# Altium project Shuttler_AMC.PrjPcb (part 12 of 20)

## Sheet DAC_LTC2000.SchDoc: =ProjectName
size 420 x 297 mm; Author: T.P.; CompanyName: WUT; DrawnBy: T.P.; Organization: WUT ISE; Address1: Warsaw Univeristy of Technology; Address2: Nowowiejska 15/19; DocumentNumber: 18; Revision: 0.9; SheetNumber: 18; SheetTotal: 36; EDA_Number: ARTIQ; Projet: ARTIQ/SINARA; ModifiedBy: -; CreateDate: XX/XX/XXXX; CheckedDate: -; Title2: DAC_LTC2000.SchDoc; DivGrp: ISE; Designer: G.K. and T.P.; ModifiedDate: -; ProjectName: ADC/DAC MEZZANINE
Used 18 times, as channels DACs/U_DAC_LTC2000, DACs/U_DAC_LTC2000, DACs/U_DAC_LTC2000, DACs/U_DAC_LTC2000, DACs/U_DAC_LTC2000, DACs/U_DAC_LTC2000, DACs/U_DAC_LTC2000, DACs/U_DAC_LTC2000, DACs/U_DAC_LTC2000, DACs/U_DAC_LTC2000, DACs/U_DAC_LTC2000, DACs/U_DAC_LTC2000, DACs/U_DAC_LTC2000, DACs/U_DAC_LTC2000, DACs/U_DAC_LTC2000, DACs/U_DAC_LTC2000, DACs/U_DAC_LTC2000, DACs/U_DAC_LTC2000. Parts and nets are listed once, with the designators drawn on the sheet.
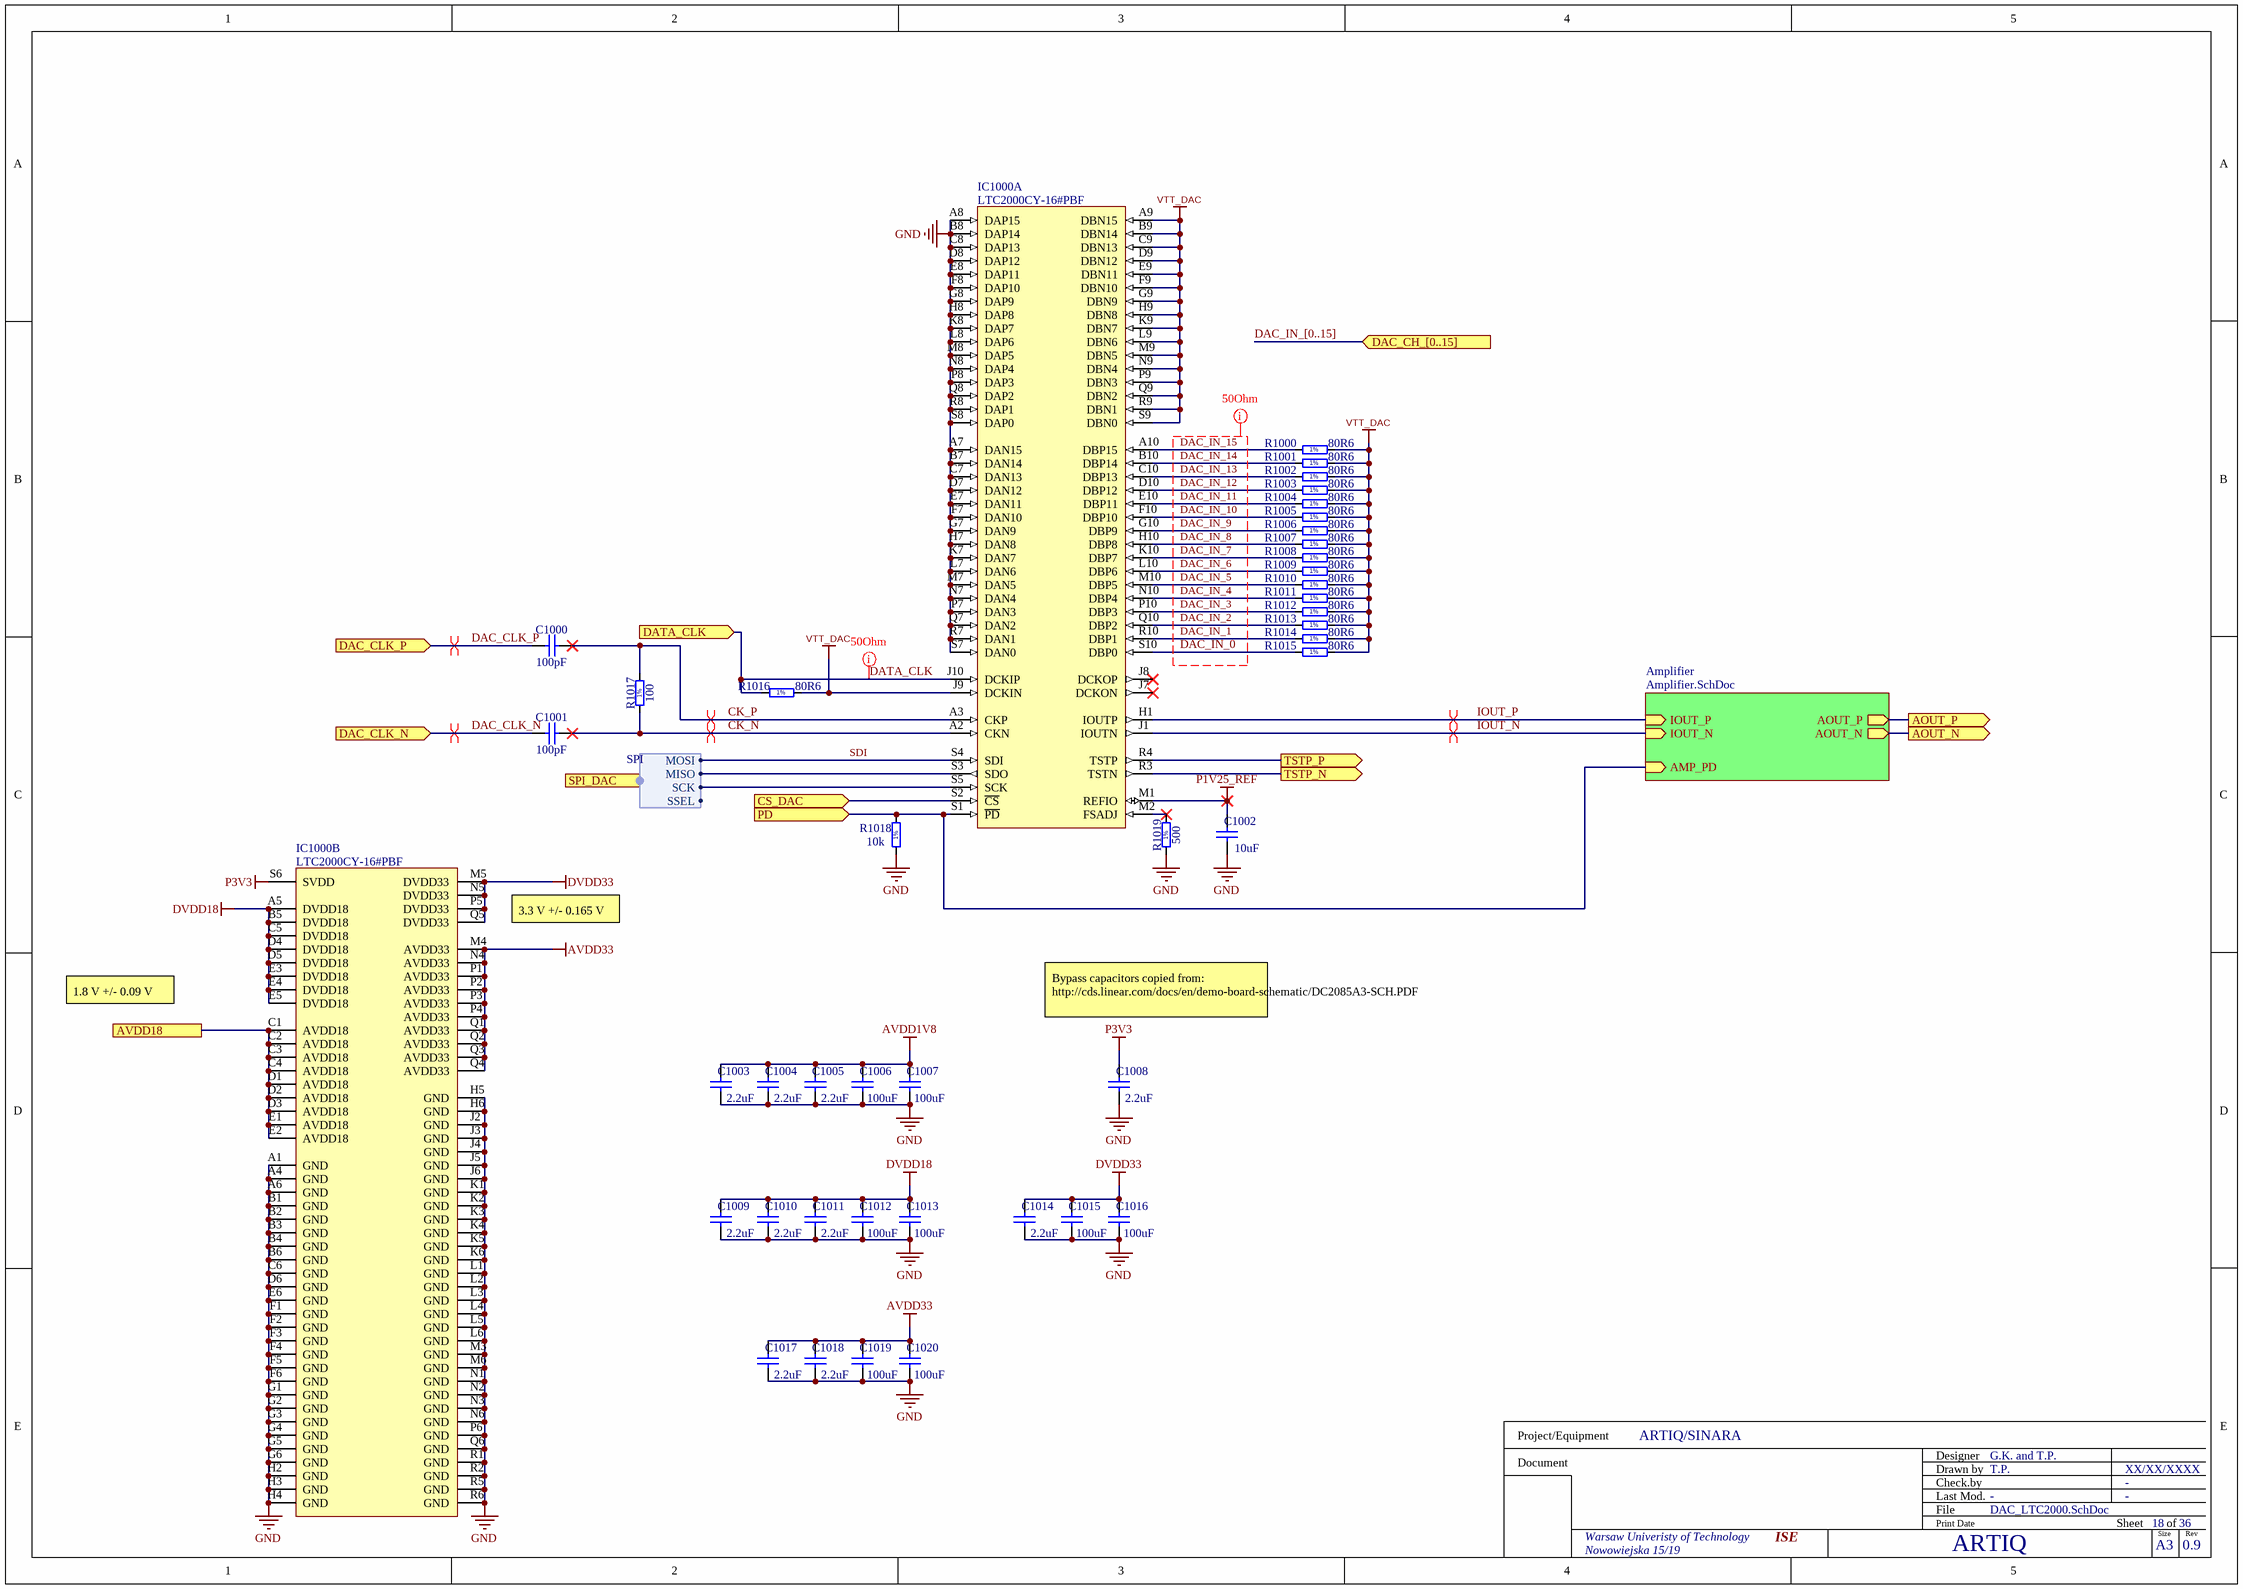
[diagram p22: DAC_LTC2000.SchDoc]

### Parts
C1000  100pF  [CAPC1005X55N]
C1001  100pF  [CAPC1005X55N]
C1002  10uF  [CAPC1005X70N]
C1003  2.2uF  [CAPC1005X55N]
C1004  2.2uF  [CAPC1005X55N]
C1005  2.2uF  [CAPC1005X55N]
C1006  100uF  [CAPC3216X180N]
C1007  100uF  [CAPC3216X180N]
C1008  2.2uF  [CAPC1005X55N]
C1009  2.2uF  [CAPC1005X55N]
C1010  2.2uF  [CAPC1005X55N]
C1011  2.2uF  [CAPC1005X55N]
C1012  100uF  [CAPC3216X180N]
C1013  100uF  [CAPC3216X180N]
C1014  2.2uF  [CAPC1005X55N]
C1015  100uF  [CAPC3216X180N]
C1016  100uF  [CAPC3216X180N]
C1017  2.2uF  [CAPC1005X55N]
C1018  2.2uF  [CAPC1005X55N]
C1019  100uF  [CAPC3216X180N]
C1020  100uF  [CAPC3216X180N]
IC1000  LTC2000CY-16#PBF  [LINEAR_BGA(170) # 05-08-1890]  (parts A,B of 2)
R1000  80R6  [RESC1005X40N]
R1001  80R6  [RESC1005X40N]
R1002  80R6  [RESC1005X40N]
R1003  80R6  [RESC1005X40N]
R1004  80R6  [RESC1005X40N]
R1005  80R6  [RESC1005X40N]
R1006  80R6  [RESC1005X40N]
R1007  80R6  [RESC1005X40N]
R1008  80R6  [RESC1005X40N]
R1009  80R6  [RESC1005X40N]
R1010  80R6  [RESC1005X40N]
R1011  80R6  [RESC1005X40N]
R1012  80R6  [RESC1005X40N]
R1013  80R6  [RESC1005X40N]
R1014  80R6  [RESC1005X40N]
R1015  80R6  [RESC1005X40N]
R1016  80R6  [RESC1005X40N]
R1017  100  [RESC0603X28N]
R1018  10k  [RESC1005X40N]
R1019  500  [RESC1608X55N]

### Sub-sheets
Amplifier = Amplifier.SchDoc: IOUT_P (in), IOUT_N (in), AMP_PD (in), AOUT_N (out), AOUT_P (out)

### Ports
AOUT_N (out), AOUT_P (out), AVDD18, CS_DAC (in), DAC_CH_[0..15] (in), DAC_CLK_N (in), DAC_CLK_P (in), DATA_CLK (in), PD (in), SPI_DAC (harness SPI), TSTP_N (out), TSTP_P (out)

### Harnesses
SPI: SCK, SSEL, MISO, MOSI

### Nets
AVDD1V8: C1003.2 C1004.2 C1005.2 C1006.2 C1007.2
AVDD33: C1017.2 C1018.2 C1019.2 C1020.2 IC1000.M4(AVDD33) IC1000.N4(AVDD33) IC1000.P1(AVDD33) IC1000.P2(AVDD33) IC1000.P3(AVDD33) IC1000.P4(AVDD33) IC1000.Q1(AVDD33) IC1000.Q2(AVDD33) IC1000.Q3(AVDD33) IC1000.Q4(AVDD33)
DVDD18: C1009.2 C1010.2 C1011.2 C1012.2 C1013.2 IC1000.A5(DVDD18) IC1000.B5(DVDD18) IC1000.C5(DVDD18) IC1000.D4(DVDD18) IC1000.D5(DVDD18) IC1000.E3(DVDD18) IC1000.E4(DVDD18) IC1000.E5(DVDD18)
DVDD33: C1014.2 C1015.2 C1016.2 IC1000.M5(DVDD33) IC1000.N5(DVDD33) IC1000.P5(DVDD33) IC1000.Q5(DVDD33)
GND: C1002.1 C1003.1 C1004.1 C1005.1 C1006.1 C1007.1 C1008.1 C1009.1 C1010.1 C1011.1 C1012.1 C1013.1 C1014.1 C1015.1 C1016.1 C1017.1 C1018.1 C1019.1 C1020.1 IC1000.A1(GND) IC1000.A4(GND) IC1000.A6(GND) IC1000.A7(DAN15) IC1000.A8(DAP15) IC1000.B1(GND) IC1000.B2(GND) IC1000.B3(GND) IC1000.B4(GND) IC1000.B6(GND) IC1000.B7(DAN14) IC1000.B8(DAP14) IC1000.C6(GND) IC1000.C7(DAN13) IC1000.C8(DAP13) IC1000.D6(GND) IC1000.D7(DAN12) IC1000.D8(DAP12) IC1000.E6(GND) IC1000.E7(DAN11) IC1000.E8(DAP11) IC1000.F1(GND) IC1000.F2(GND) IC1000.F3(GND) IC1000.F4(GND) IC1000.F5(GND) IC1000.F6(GND) IC1000.F7(DAN10) IC1000.F8(DAP10) IC1000.G1(GND) IC1000.G2(GND) IC1000.G3(GND) IC1000.G4(GND) IC1000.G5(GND) IC1000.G6(GND) IC1000.G7(DAN9) IC1000.G8(DAP9) IC1000.H2(GND) IC1000.H3(GND) IC1000.H4(GND) IC1000.H5(GND) IC1000.H6(GND) IC1000.H7(DAN8) IC1000.H8(DAP8) IC1000.J2(GND) IC1000.J3(GND) IC1000.J4(GND) IC1000.J5(GND) IC1000.J6(GND) IC1000.K1(GND) IC1000.K2(GND) IC1000.K3(GND) IC1000.K4(GND) IC1000.K5(GND) IC1000.K6(GND) IC1000.K7(DAN7) IC1000.K8(DAP7) IC1000.L1(GND) IC1000.L2(GND) IC1000.L3(GND) IC1000.L4(GND) IC1000.L5(GND) IC1000.L6(GND) IC1000.L7(DAN6) IC1000.L8(DAP6) IC1000.M3(GND) IC1000.M6(GND) IC1000.M7(DAN5) IC1000.M8(DAP5) IC1000.N1(GND) IC1000.N2(GND) IC1000.N3(GND) IC1000.N6(GND) IC1000.N7(DAN4) IC1000.N8(DAP4) IC1000.P6(GND) IC1000.P7(DAN3) IC1000.P8(DAP3) IC1000.Q6(GND) IC1000.Q7(DAN2) IC1000.Q8(DAP2) IC1000.R1(GND) IC1000.R2(GND) IC1000.R5(GND) IC1000.R6(GND) IC1000.R7(DAN1) IC1000.R8(DAP1) IC1000.S7(DAN0) IC1000.S8(DAP0) R1018.1 R1019.1
P1V25_REF: C1002.2 IC1000.M1(REFIO)
P3V3: C1008.2 IC1000.S6(SVDD)
VTT_DAC: IC1000.A9(DBN15) IC1000.B9(DBN14) IC1000.C9(DBN13) IC1000.D9(DBN12) IC1000.E9(DBN11) IC1000.F9(DBN10) IC1000.G9(DBN9) IC1000.H9(DBN8) IC1000.J9(DCKIN) IC1000.K9(DBN7) IC1000.L9(DBN6) IC1000.M9(DBN5) IC1000.N9(DBN4) IC1000.P9(DBN3) IC1000.Q9(DBN2) IC1000.R9(DBN1) IC1000.S9(DBN0) R1000.2 R1001.2 R1002.2 R1003.2 R1004.2 R1005.2 R1006.2 R1007.2 R1008.2 R1009.2 R1010.2 R1011.2 R1012.2 R1013.2 R1014.2 R1015.2 R1016.2
AOUT_N: port AOUT_N, sheet Amplifier/AOUT_N
AOUT_P: port AOUT_P, sheet Amplifier/AOUT_P
AVDD18: IC1000.C1(AVDD18) IC1000.C2(AVDD18) IC1000.C3(AVDD18) IC1000.C4(AVDD18) IC1000.D1(AVDD18) IC1000.D2(AVDD18) IC1000.D3(AVDD18) IC1000.E1(AVDD18) IC1000.E2(AVDD18) ; port AVDD18
CK_N: C1001.2 IC1000.A2(CKN) R1017.1
CK_P: C1000.2 IC1000.A3(CKP) R1017.2
CS_DAC: IC1000.S2(~{CS}) ; port CS_DAC
DAC_CLK_N: C1001.1 ; port DAC_CLK_N
DAC_CLK_P: C1000.1 ; port DAC_CLK_P
DAC_IN_0: IC1000.S10(DBP0) R1015.1
DAC_IN_1: IC1000.R10(DBP1) R1014.1
DAC_IN_2: IC1000.Q10(DBP2) R1013.1
DAC_IN_3: IC1000.P10(DBP3) R1012.1
DAC_IN_4: IC1000.N10(DBP4) R1011.1
DAC_IN_5: IC1000.M10(DBP5) R1010.1
DAC_IN_6: IC1000.L10(DBP6) R1009.1
DAC_IN_7: IC1000.K10(DBP7) R1008.1
DAC_IN_8: IC1000.H10(DBP8) R1007.1
DAC_IN_9: IC1000.G10(DBP9) R1006.1
DAC_IN_10: IC1000.F10(DBP10) R1005.1
DAC_IN_11: IC1000.E10(DBP11) R1004.1
DAC_IN_12: IC1000.D10(DBP12) R1003.1
DAC_IN_13: IC1000.C10(DBP13) R1002.1
DAC_IN_14: IC1000.B10(DBP14) R1001.1
DAC_IN_15: IC1000.A10(DBP15) R1000.1
DATA_CLK: IC1000.J10(DCKIP) R1016.1 ; port DATA_CLK
IOUT_N: IC1000.J1(IOUTN) ; sheet Amplifier/IOUT_N
IOUT_P: IC1000.H1(IOUTP) ; sheet Amplifier/IOUT_P
PD: IC1000.S1(~{PD}) R1018.2 ; port PD, sheet Amplifier/AMP_PD
SDI: IC1000.S4(SDI) ; port SPI_DAC.MOSI
TSTP_N: IC1000.R3(TSTN) ; port TSTP_N
TSTP_P: IC1000.R4(TSTP) ; port TSTP_P
NetIC1000_M2: IC1000.M2(FSADJ) R1019.2
NetIC1000_S3: IC1000.S3(SDO) ; port SPI_DAC.MISO
NetIC1000_S5: IC1000.S5(SCK) ; port SPI_DAC.SCK

Not connected (* = marked no-connect by the designer): IC1000 J7(DCKON)* J8(DCKOP)*

### Channels
DACs/U_DAC_LTC2000: designators end in _DACs_U_DAC_LTC2000#1; ports AOUT_N=AOUT_N12 AOUT_P=AOUT_P12 AVDD18=AVDD18_B CS_DAC=CS_12 DAC_CLK_N=DAC_CLK_IN.CLK12_N DAC_CLK_P=DAC_CLK_IN.CLK12_P DATA_CLK=DAC_DATA_CLK_12 PD=DAC_PD12 TSTP_N=TSTP_12_N TSTP_P=TSTP_12_P
DACs/U_DAC_LTC2000: designators end in _DACs_U_DAC_LTC2000#2; ports AOUT_N=AOUT_N13 AOUT_P=AOUT_P13 AVDD18=AVDD18_B CS_DAC=CS_13 DAC_CLK_N=DAC_CLK_IN.CLK13_N DAC_CLK_P=DAC_CLK_IN.CLK13_P DATA_CLK=DAC_DATA_CLK_13 PD=DAC_PD13 TSTP_N=TSTP_13_N TSTP_P=TSTP_13_P
DACs/U_DAC_LTC2000: designators end in _DACs_U_DAC_LTC2000#3; ports AOUT_N=AOUT_N14 AOUT_P=AOUT_P14 AVDD18=AVDD18_B CS_DAC=CS_14 DAC_CLK_N=DAC_CLK_IN.CLK14_N DAC_CLK_P=DAC_CLK_IN.CLK14_P DATA_CLK=DAC_DATA_CLK_14 PD=DAC_PD14 TSTP_N=TSTP_14_N TSTP_P=TSTP_14_P
DACs/U_DAC_LTC2000: designators end in _DACs_U_DAC_LTC2000#4; ports AOUT_N=AOUT_N15 AOUT_P=AOUT_P15 AVDD18=AVDD18_B CS_DAC=CS_15 DAC_CLK_N=DAC_CLK_IN.CLK15_N DAC_CLK_P=DAC_CLK_IN.CLK15_P DATA_CLK=DAC_DATA_CLK_15 PD=DAC_PD15 TSTP_N=TSTP_15_N TSTP_P=TSTP_15_P
DACs/U_DAC_LTC2000: designators end in _DACs_U_DAC_LTC2000#5; ports AOUT_N=AOUT_N16 AOUT_P=AOUT_P16 AVDD18=AVDD18_B CS_DAC=CS_16 DAC_CLK_N=DAC_CLK_IN.CLK16_N DAC_CLK_P=DAC_CLK_IN.CLK16_P DATA_CLK=DAC_DATA_CLK_16 PD=DAC_PD16 TSTP_N=TSTP_16_N TSTP_P=TSTP_16_P
DACs/U_DAC_LTC2000: designators end in _DACs_U_DAC_LTC2000#6; ports AOUT_N=AOUT_N17 AOUT_P=AOUT_P17 AVDD18=AVDD18_B CS_DAC=CS_17 DAC_CLK_N=DAC_CLK_IN.CLK17_N DAC_CLK_P=DAC_CLK_IN.CLK17_P DATA_CLK=DAC_DATA_CLK_17 PD=DAC_PD17 TSTP_N=TSTP_17_N TSTP_P=TSTP_17_P
DACs/U_DAC_LTC2000: designators end in _DACs_U_DAC_LTC2000#7; ports AOUT_N=AOUT_N6 AOUT_P=AOUT_P6 AVDD18=AVDD18_A CS_DAC=CS_6 DAC_CLK_N=DAC_CLK_IN.CLK6_N DAC_CLK_P=DAC_CLK_IN.CLK6_P DATA_CLK=DAC_DATA_CLK_6 PD=DAC_PD6 TSTP_N=TSTP_6_N TSTP_P=TSTP_6_P
DACs/U_DAC_LTC2000: designators end in _DACs_U_DAC_LTC2000#8; ports AOUT_N=AOUT_N7 AOUT_P=AOUT_P7 AVDD18=AVDD18_B CS_DAC=CS_7 DAC_CLK_N=DAC_CLK_IN.CLK7_N DAC_CLK_P=DAC_CLK_IN.CLK7_P DATA_CLK=DAC_DATA_CLK_7 PD=DAC_PD7 TSTP_N=TSTP_7_N TSTP_P=TSTP_7_P
DACs/U_DAC_LTC2000: designators end in _DACs_U_DAC_LTC2000#9; ports AOUT_N=AOUT_N8 AOUT_P=AOUT_P8 AVDD18=AVDD18_A CS_DAC=CS_8 DAC_CLK_N=DAC_CLK_IN.CLK8_N DAC_CLK_P=DAC_CLK_IN.CLK8_P DATA_CLK=DAC_DATA_CLK_8 PD=DAC_PD8 TSTP_N=TSTP_8_N TSTP_P=TSTP_8_P
DACs/U_DAC_LTC2000: designators end in _DACs_U_DAC_LTC2000#10; ports AOUT_N=AOUT_N9 AOUT_P=AOUT_P9 AVDD18=AVDD18_B CS_DAC=CS_9 DAC_CLK_N=DAC_CLK_IN.CLK9_N DAC_CLK_P=DAC_CLK_IN.CLK9_P DATA_CLK=DAC_DATA_CLK_9 PD=DAC_PD9 TSTP_N=TSTP_9_N TSTP_P=TSTP_9_P
DACs/U_DAC_LTC2000: designators end in _DACs_U_DAC_LTC2000#11; ports AOUT_N=AOUT_N10 AOUT_P=AOUT_P10 AVDD18=AVDD18_B CS_DAC=CS_10 DAC_CLK_N=DAC_CLK_IN.CLK10_N DAC_CLK_P=DAC_CLK_IN.CLK10_P DATA_CLK=DAC_DATA_CLK_10 PD=DAC_PD10 TSTP_N=TSTP_10_N TSTP_P=TSTP_10_P
DACs/U_DAC_LTC2000: designators end in _DACs_U_DAC_LTC2000#12; ports AOUT_N=AOUT_N11 AOUT_P=AOUT_P11 AVDD18=AVDD18_B CS_DAC=CS_11 DAC_CLK_N=DAC_CLK_IN.CLK11_N DAC_CLK_P=DAC_CLK_IN.CLK11_P DATA_CLK=DAC_DATA_CLK_11 PD=DAC_PD11 TSTP_N=TSTP_11_N TSTP_P=TSTP_11_P
DACs/U_DAC_LTC2000: designators end in _DACs_U_DAC_LTC2000#13; ports AOUT_N=AOUT_N0 AOUT_P=AOUT_P0 AVDD18=AVDD18_A CS_DAC=CS_0 DAC_CLK_N=DAC_CLK_IN.CLK0_N DAC_CLK_P=DAC_CLK_IN.CLK0_P DATA_CLK=DAC_DATA_CLK_0 PD=DAC_PD0 TSTP_N=TSTP_0_N TSTP_P=TSTP_0_P
DACs/U_DAC_LTC2000: designators end in _DACs_U_DAC_LTC2000#14; ports AOUT_N=AOUT_N1 AOUT_P=AOUT_P1 AVDD18=AVDD18_A CS_DAC=CS_1 DAC_CLK_N=DAC_CLK_IN.CLK1_N DAC_CLK_P=DAC_CLK_IN.CLK1_P DATA_CLK=DAC_DATA_CLK_1 PD=DAC_PD1 TSTP_N=TSTP_1_N TSTP_P=TSTP_1_P
DACs/U_DAC_LTC2000: designators end in _DACs_U_DAC_LTC2000#15; ports AOUT_N=AOUT_N2 AOUT_P=AOUT_P2 AVDD18=AVDD18_A CS_DAC=CS_2 DAC_CLK_N=DAC_CLK_IN.CLK2_N DAC_CLK_P=DAC_CLK_IN.CLK2_P DATA_CLK=DAC_DATA_CLK_2 PD=DAC_PD2 TSTP_N=TSTP_2_N TSTP_P=TSTP_2_P
DACs/U_DAC_LTC2000: designators end in _DACs_U_DAC_LTC2000#16; ports AOUT_N=AOUT_N3 AOUT_P=AOUT_P3 AVDD18=AVDD18_A CS_DAC=CS_3 DAC_CLK_N=DAC_CLK_IN.CLK3_N DAC_CLK_P=DAC_CLK_IN.CLK3_P DATA_CLK=DAC_DATA_CLK_3 PD=DAC_PD3 TSTP_N=TSTP_3_N TSTP_P=TSTP_3_P
DACs/U_DAC_LTC2000: designators end in _DACs_U_DAC_LTC2000#17; ports AOUT_N=AOUT_N4 AOUT_P=AOUT_P4 AVDD18=AVDD18_A CS_DAC=CS_4 DAC_CLK_N=DAC_CLK_IN.CLK4_N DAC_CLK_P=DAC_CLK_IN.CLK4_P DATA_CLK=DAC_DATA_CLK_4 PD=DAC_PD4 TSTP_N=TSTP_4_N TSTP_P=TSTP_4_P
DACs/U_DAC_LTC2000: designators end in _DACs_U_DAC_LTC2000#18; ports AOUT_N=AOUT_N5 AOUT_P=AOUT_P5 AVDD18=AVDD18_A CS_DAC=CS_5 DAC_CLK_N=DAC_CLK_IN.CLK5_N DAC_CLK_P=DAC_CLK_IN.CLK5_P DATA_CLK=DAC_DATA_CLK_5 PD=DAC_PD5 TSTP_N=TSTP_5_N TSTP_P=TSTP_5_P

### Buses and harness runs
bus DAC_IN_[0..15] = port DAC_CH_[0..15]

### Layout directives
differential pair; differential pair class I_analog: IOUT_N_U_DAC_LTC2000, IOUT_P_U_DAC_LTC2000
differential pair; differential pair class Diff_100Ohm: CK_N_U_DAC_LTC2000, CK_P_U_DAC_LTC2000, DAC_CLK_IN.CLK12_N, DAC_CLK_IN.CLK12_P
mark named 50Ohm: DAC_DATA_CLK_12, DAC_IN_0, DAC_IN_1, DAC_IN_2, DAC_IN_3, DAC_IN_4, DAC_IN_5, DAC_IN_6, DAC_IN_7, DAC_IN_8, DAC_IN_9, DAC_IN_10, DAC_IN_11, DAC_IN_12, DAC_IN_13, DAC_IN_14, DAC_IN_15

### Notes on the sheet
- 3.3 V +/- 0.165 V
- 1.8 V +/- 0.09 V
- Bypass capacitors copied from:
  http://cds.linear.com/docs/en/demo-board-schematic/DC2085A3-SCH.PDF
- Project/Equipment
- Document
- Designer
- Drawn by
- Check.by
- File
- Last Mod.
- Print Date
- Sheet
- Size
- A3
- of
- Rev
- (in symbol R0201_100R_1%_0.05W_200PPM) 1%
- (in symbol R0402_10K_1%_0.0625W_100PPM) 1%
- (in symbol R0402_80R6_1%_0.1W_100PPM) 1%
- (in symbol R0603_500R_1%_0.1W_100PPM) 1%

### Library data of the parts
C1000 C1001 = CC0402_100PF_25V_1%_C0G_KEMET_HiQ-CBR: Non-polarised capacitor; Part Description: High Q and low ESR, SMD Multilayer Chip Ceramic Capacitor, HiQ-CBR Series; Manufacturer: KEMET; Manufacturer Part Number: CBR04C101F3GAC; Voltage: 25V; TC: C0G/NP0; Tolerance: ±1%; Part Number: CC0402_100PF_25V_1%_C0G_KEMET_HiQ-CBR; Component Kind: Standard; Component Type: Standard; Pin Count: 2; Value: 100pF; Status: Not Recommended; Case: 0402; Mounted: Yes; Socket: No; SMD: Yes; Sense: No; ComponentHeight: 0.55mm; HelpURL: \\cern.ch\dfs\Applications\Altium\Datasheets\CC0402_C0G_KEMET_HiQ-CBR.pdf; Author: CERN DEM BC; CreateDate: 17.11.2017; LatestRevisionDate: 21.11.2017
C1002 = CC0402_10UF_6.3V_20%_X5R: Non-polarised capacitor; Part Description: SMD Multilayer Chip Ceramic Capacitor; Manufacturer: GENERIC; Manufacturer1 Part Number: C1005X5R0J106M050BC; Voltage: 6.3V; TC: X5R; Tolerance: ±10%; Part Number: CC0402_10UF_6.3V_20%_X5R; Component Kind: Standard; Component Type: Standard; Pin Count: 2; Value: 10uF; Status: Preferred; Manufacturer Part Number: CC0402_10UF_6.3V_20%_X5R; Case: 0402; Mounted: Yes; Socket: No; SMD: Yes; Sense: No; Manufacturer1 Example: TDK; Manufacturer1 ComponentHeight: 0.70mm; HelpURL: \\cern.ch\dfs\Applications\Altium\Datasheets\CC0402_X5R_TDK_C.pdf; Author: CERN DEM JLC; CreateDate: 07.01.2015; LatestRevisionDate: 07.01.2015
C1003-C1005 C1008-C1011 C1014 C1017 C1018 = CC0402_2.2UF_6.3V_10%_X5R: Non-polarised capacitor; Part Description: SMD Multilayer Chip Ceramic Capacitor; Manufacturer: GENERIC; Manufacturer1 Part Number: C1005X5R0J225K050BC; Voltage: 6.3V; TC: X5R; Tolerance: ±10%; Part Number: CC0402_2.2UF_6.3V_10%_X5R; Component Kind: Standard; Component Type: Standard; Pin Count: 2; Value: 2.2uF; Status: Preferred; Manufacturer Part Number: CC0402_2.2UF_6.3V_10%_X5R; Case: 0402; Mounted: Yes; Socket: No; SMD: Yes; Sense: No; Manufacturer1 Example: TDK; Manufacturer1 ComponentHeight: 0.55mm; HelpURL: \\cern.ch\dfs\Applications\Altium\Datasheets\CC0402_X5R_TDK_C.pdf; Author: CERN DEM JMW; CreateDate: 22.09.2015; LatestRevisionDate: 22.09.2015
C1006 C1007 C1012 C1013 C1015 C1016 C1019 C1020 = CC1206_100UF_6.3V_20%_X5R: Non-polarised capacitor; Part Description: SMD Multilayer Chip Ceramic Capacitor; Manufacturer: GENERIC; Manufacturer1 Part Number: C1206C107M9PACTU; Voltage: 6.3V; TC: X5R; Tolerance: ±10%; Part Number: CC1206_100UF_6.3V_20%_X5R; Component Kind: Standard; Component Type: Standard; Pin Count: 2; Value: 100uF; Status: None; Manufacturer Part Number: CC1206_100UF_6.3V_20%_X5R; Case: 1206; Mounted: Yes; Socket: No; SMD: Yes; Sense: No; Manufacturer1 Example: KEMET; Manufacturer1 ComponentHeight: 1.8mm; HelpURL: \\cern.ch\dfs\Applications\Altium\Datasheets\CC1206_X5R_KEMET.pdf; Author: CERN DEM JLC; CreateDate: 26.09.2012; LatestRevisionDate: 26.09.2012
IC1000 = LTC2000CY-16#PBF: 16-Bit 2.5Gsps DAC; Manufacturer: LINEAR TECHNOLOGY; Autho: CERN / TP; Bonding: No; PressFit: No; HelpURL: \\cern.ch\dfs\Applications\Altium\Datasheets\LTC2000CY-16#PBF.pdf; LatestRevisionDate: 30.01.2019; Part Number: LTC2000CY-16#PBF; Part Description: 16-Bit 2.5Gsps DAC; Manufacturer Part Number: LTC2000CY-16#PBF; PackageDescription: BGA, 0.80mm Pitch, Rect.; 170 Pin, 10 Columns X 17 Rows, 9.00mm X 15.00mm X 1.69mm H, LTC DWG # 05-08-1890; Mounted: Yes; Case: BGA170; Component Kind: Standard; Component Type: Standard; ComponentHeight: 1.69mm; CreateDate: 29.09.2017; Device: LTC2000CY-16#PBF; Pin Count: 170; Sense: No; SMD: Yes; Socket: No
R1000-R1016 = R0402_80R6_1%_0.1W_100PPM: Resistor - 1%; Part Description: General Purpose Thick Film Chip Resistor; Manufacturer: GENERIC; Manufacturer1 Part Number: ERJ2RKF80R6X; Power: 0.1W; TC: ±100ppm/°C; Voltage: 50V; PressFit: No; Part Number: R0402_80R6_1%_0.1W_100PPM; Component Kind: Standard; Component Type: Standard; Pin Count: 2; Value: 80R6; Status: Not Recommended; Tolerance: ±1%; Manufacturer Part Number: R0402_80R6_1%_0.1W_100PPM; Case: 0402; Mounted: Yes; Sense: No; Socket: No; SMD: Yes; Manufacturer1 Example: PANASONIC; Manufacturer1 ComponentHeight: 0.4mm; HelpURL: \\cern.ch\dfs\Applications\Altium\Datasheets\R0402_PANASONIC_ERJ2RK.pdf; Author: CERN DEM JLC; CreateDate: 03.03.2015; LatestRevisionDate: 03.03.2015
R1017 = R0201_100R_1%_0.05W_200PPM: Resistor - 1%; Part Description: Thick Film Chip Resistor; Manufacturer: GENERIC; Manufacturer1 Part Number: CRCW0201100RFNED; Power: 0.05W; TC: ±200ppm/°C; PressFit: No; Part Number: R0201_100R_1%_0.05W_200PPM; Component Kind: Standard; Component Type: Standard; Pin Count: 2; Value: 100; Status: Not Recommended; Tolerance: ±1%; Manufacturer Part Number: R0201_100R_1%_0.05W_200PPM; Case: 0201; Mounted: Yes; Sense: No; Socket: No; SMD: Yes; Manufacturer1 Example: VISHAY; Manufacturer1 ComponentHeight: 0.27mm; HelpURL: \\cern.ch\dfs\Applications\Altium\Datasheets\R0201_VISHAY_CRCW0201 e3.pdf; Author: CERN DEM JLC; CreateDate: 13.11.2014; LatestRevisionDate: 13.11.2014
R1018 = R0402_10K_1%_0.0625W_100PPM: Resistor - 1%; Manufacturer: GENERIC; Part Description: General Purpose Thick Film Chip Resistor; Manufacturer1 Part Number: 232270671003L; TC: ±100ppm/°C; PressFit: No; Manufacturer Part Number: R0402_10K_1%_0.0625W_100PPM; Part Number: R0402_10K_1%_0.0625W_100PPM; Tolerance: ±1%; Value: 10k; Component Kind: Standard; Component Type: Standard; Pin Count: 2; Status: Not Recommended; Power: 0.0625W; Case: 0402; Mounted: Yes; Sense: No; Socket: No; SMD: Yes; Manufacturer1 Example: YAGEO PHYCOMP; Manufacturer1 ComponentHeight: 0.4mm; HelpURL: \\cern.ch\dfs\Applications\Altium\Datasheets\R0402_Phycomp_RC0402.pdf; Author: CERN DEM JLC; CreateDate: 03.12.2007; LatestRevisionDate: 17.10.2012
R1019 = R0603_500R_1%_0.1W_100PPM: Resistor - 1%; Part Description: General Purpose Thick Film Chip Resistor; Manufacturer: GENERIC; Manufacturer1 Part Number: CRCW0603500RFKEA; Power: 0.1W; TC: ±100ppm/°C; PressFit: No; Part Number: R0603_500R_1%_0.1W_100PPM; Component Kind: Standard; Component Type: Standard; Pin Count: 2; Value: 500; Status: Preferred; Tolerance: ±1%; Manufacturer Part Number: R0603_500R_1%_0.1W_100PPM; Case: 0603; Mounted: Yes; Sense: No; Socket: No; SMD: Yes; Manufacturer1 Example: VISHAY; Manufacturer1 ComponentHeight: 0.50mm; HelpURL: \\cern.ch\dfs\Applications\Altium\Datasheets\R0603_VISHAY_CRCW e3.pdf; Author: CERN DEM JLC; CreateDate: 21.03.2018; LatestRevisionDate: 21.03.2018

## Sheet Amplifier.SchDoc: =ProjectName
size 420 x 297 mm; Author: T.P.; CompanyName: WUT; DrawnBy: T.P.; Organization: WUT ISE; Address1: Warsaw Univeristy of Technology; Address2: Nowowiejska 15/19; DocumentNumber: 19; Revision: 0.9; SheetNumber: 19; SheetTotal: 36; EDA_Number: ARTIQ; Projet: ARTIQ/SINARA; ModifiedBy: -; CreateDate: XX/XX/XXXX; CheckedDate: -; Title2: Amplifier.SchDoc; DivGrp: ISE; Designer: G.K. and T.P.
Used 18 times, as channels DACs/U_DAC_LTC2000/Amplifier, DACs/U_DAC_LTC2000/Amplifier, DACs/U_DAC_LTC2000/Amplifier, DACs/U_DAC_LTC2000/Amplifier, DACs/U_DAC_LTC2000/Amplifier, DACs/U_DAC_LTC2000/Amplifier, DACs/U_DAC_LTC2000/Amplifier, DACs/U_DAC_LTC2000/Amplifier, DACs/U_DAC_LTC2000/Amplifier, DACs/U_DAC_LTC2000/Amplifier, DACs/U_DAC_LTC2000/Amplifier, DACs/U_DAC_LTC2000/Amplifier, DACs/U_DAC_LTC2000/Amplifier, DACs/U_DAC_LTC2000/Amplifier, DACs/U_DAC_LTC2000/Amplifier, DACs/U_DAC_LTC2000/Amplifier, DACs/U_DAC_LTC2000/Amplifier, DACs/U_DAC_LTC2000/Amplifier. Parts and nets are listed once, with the designators drawn on the sheet.
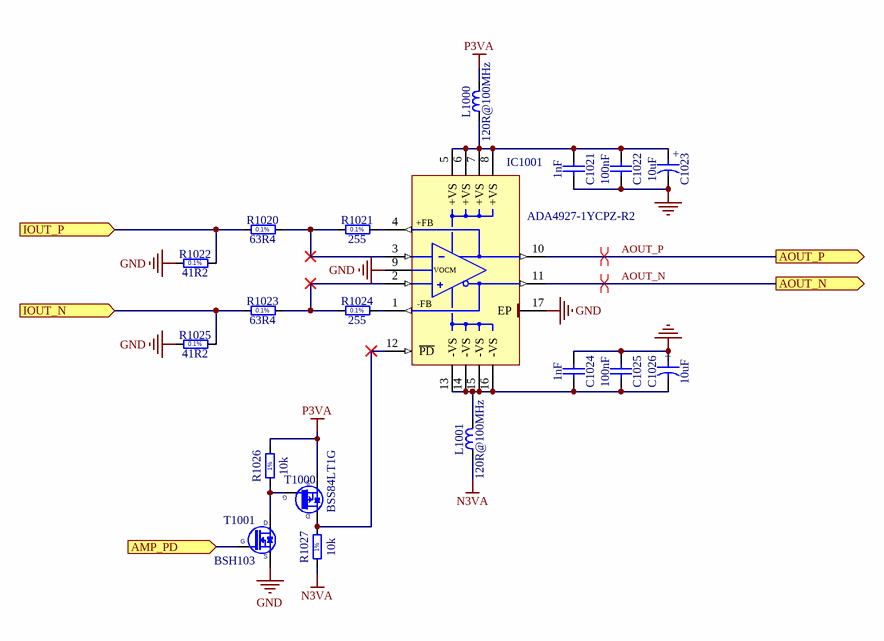
[diagram p23: Amplifier.SchDoc]

### Parts
C1021  1nF  [CAPC0603X33N]
C1022  100nF  [CAPC0603X33N]
C1023  10uF  [CAPMP3216X180N]
C1024  1nF  [CAPC0603X33N]
C1025  100nF  [CAPC0603X33N]
C1026  10uF  [CAPMP3216X180N]
IC1001  ADA4927-1YCPZ-R2  [QFN50P300X300X100-17N-S145]
L1000  120R@100MHz  [INDC1608X95N]
L1001  120R@100MHz  [INDC1608X95N]
R1020  63R4  [RESC1005X35N]
R1021  255  [RESC1608X55N]
R1022  41R2  [RESC1608X55N]
R1023  63R4  [RESC1005X35N]
R1024  255  [RESC1608X55N]
R1025  41R2  [RESC1608X55N]
R1026  10k  [RESC1005X40N]
R1027  10k  [RESC1005X40N]
T1000  BSS84LT1G  [SOT95P240X110-3N]
T1001  BSH103  [SOT95P230X110-3N]

### Ports
AMP_PD (in), AOUT_N (out), AOUT_P (out), IOUT_N (in), IOUT_P (in)

### Nets
GND: C1021.2 C1022.2 C1023.2 C1024.2 C1025.2 C1026.1 IC1001.9(VOCM) IC1001.17(EP) R1022.1 R1025.1 T1001.2(S)
N3VA: L1001.1 R1027.2
P3VA: L1000.2 R1026.1 T1000.2(S)
AMP_PD: T1001.1(G) ; port AMP_PD
AOUT_N: IC1001.11(-OUT) ; port AOUT_N
AOUT_P: IC1001.10(+OUT) ; port AOUT_P
IOUT_N: R1023.1 R1025.2 ; port IOUT_N
IOUT_P: R1020.1 R1022.2 ; port IOUT_P
NetC1021_1: C1021.1 C1022.1 C1023.1 IC1001.5(+VS) IC1001.6(+VS) IC1001.7(+VS) IC1001.8(+VS) L1000.1
NetC1024_1: C1024.1 C1025.1 C1026.2 IC1001.13(-VS) IC1001.14(-VS) IC1001.15(-VS) IC1001.16(-VS) L1001.2
NetIC1001_1: IC1001.1(-FB) R1024.2
NetIC1001_2: IC1001.2(+IN) R1023.2 R1024.1
NetIC1001_3: IC1001.3(-IN) R1020.2 R1021.1
NetIC1001_4: IC1001.4(+FB) R1021.2
NetIC1001_12: IC1001.12(~{PD}) R1027.1 T1000.3(D)
NetR1026_2: R1026.2 T1000.1(G) T1001.3(D)

### Channels
DACs/U_DAC_LTC2000/Amplifier: designators end in _DACs_U_DAC_LTC2000_Amplifier#1; ports AMP_PD=DAC_PD12 AOUT_N=AOUT_N12 AOUT_P=AOUT_P12 IOUT_N=IOUT_N_U_DAC_LTC2000 IOUT_P=IOUT_P_U_DAC_LTC2000
DACs/U_DAC_LTC2000/Amplifier: designators end in _DACs_U_DAC_LTC2000_Amplifier#2; ports AMP_PD=DAC_PD13 AOUT_N=AOUT_N13 AOUT_P=AOUT_P13 IOUT_N=IOUT_N_U_DAC_LTC2000 IOUT_P=IOUT_P_U_DAC_LTC2000
DACs/U_DAC_LTC2000/Amplifier: designators end in _DACs_U_DAC_LTC2000_Amplifier#3; ports AMP_PD=DAC_PD14 AOUT_N=AOUT_N14 AOUT_P=AOUT_P14 IOUT_N=IOUT_N_U_DAC_LTC2000 IOUT_P=IOUT_P_U_DAC_LTC2000
DACs/U_DAC_LTC2000/Amplifier: designators end in _DACs_U_DAC_LTC2000_Amplifier#4; ports AMP_PD=DAC_PD15 AOUT_N=AOUT_N15 AOUT_P=AOUT_P15 IOUT_N=IOUT_N_U_DAC_LTC2000 IOUT_P=IOUT_P_U_DAC_LTC2000
DACs/U_DAC_LTC2000/Amplifier: designators end in _DACs_U_DAC_LTC2000_Amplifier#5; ports AMP_PD=DAC_PD16 AOUT_N=AOUT_N16 AOUT_P=AOUT_P16 IOUT_N=IOUT_N_U_DAC_LTC2000 IOUT_P=IOUT_P_U_DAC_LTC2000
DACs/U_DAC_LTC2000/Amplifier: designators end in _DACs_U_DAC_LTC2000_Amplifier#6; ports AMP_PD=DAC_PD17 AOUT_N=AOUT_N17 AOUT_P=AOUT_P17 IOUT_N=IOUT_N_U_DAC_LTC2000 IOUT_P=IOUT_P_U_DAC_LTC2000
DACs/U_DAC_LTC2000/Amplifier: designators end in _DACs_U_DAC_LTC2000_Amplifier#7; ports AMP_PD=DAC_PD6 AOUT_N=AOUT_N6 AOUT_P=AOUT_P6 IOUT_N=IOUT_N_U_DAC_LTC2000 IOUT_P=IOUT_P_U_DAC_LTC2000
DACs/U_DAC_LTC2000/Amplifier: designators end in _DACs_U_DAC_LTC2000_Amplifier#8; ports AMP_PD=DAC_PD7 AOUT_N=AOUT_N7 AOUT_P=AOUT_P7 IOUT_N=IOUT_N_U_DAC_LTC2000 IOUT_P=IOUT_P_U_DAC_LTC2000
DACs/U_DAC_LTC2000/Amplifier: designators end in _DACs_U_DAC_LTC2000_Amplifier#9; ports AMP_PD=DAC_PD8 AOUT_N=AOUT_N8 AOUT_P=AOUT_P8 IOUT_N=IOUT_N_U_DAC_LTC2000 IOUT_P=IOUT_P_U_DAC_LTC2000
DACs/U_DAC_LTC2000/Amplifier: designators end in _DACs_U_DAC_LTC2000_Amplifier#10; ports AMP_PD=DAC_PD9 AOUT_N=AOUT_N9 AOUT_P=AOUT_P9 IOUT_N=IOUT_N_U_DAC_LTC2000 IOUT_P=IOUT_P_U_DAC_LTC2000
DACs/U_DAC_LTC2000/Amplifier: designators end in _DACs_U_DAC_LTC2000_Amplifier#11; ports AMP_PD=DAC_PD10 AOUT_N=AOUT_N10 AOUT_P=AOUT_P10 IOUT_N=IOUT_N_U_DAC_LTC2000 IOUT_P=IOUT_P_U_DAC_LTC2000
DACs/U_DAC_LTC2000/Amplifier: designators end in _DACs_U_DAC_LTC2000_Amplifier#12; ports AMP_PD=DAC_PD11 AOUT_N=AOUT_N11 AOUT_P=AOUT_P11 IOUT_N=IOUT_N_U_DAC_LTC2000 IOUT_P=IOUT_P_U_DAC_LTC2000
DACs/U_DAC_LTC2000/Amplifier: designators end in _DACs_U_DAC_LTC2000_Amplifier#13; ports AMP_PD=DAC_PD0 AOUT_N=AOUT_N0 AOUT_P=AOUT_P0 IOUT_N=IOUT_N_U_DAC_LTC2000 IOUT_P=IOUT_P_U_DAC_LTC2000
DACs/U_DAC_LTC2000/Amplifier: designators end in _DACs_U_DAC_LTC2000_Amplifier#14; ports AMP_PD=DAC_PD1 AOUT_N=AOUT_N1 AOUT_P=AOUT_P1 IOUT_N=IOUT_N_U_DAC_LTC2000 IOUT_P=IOUT_P_U_DAC_LTC2000
DACs/U_DAC_LTC2000/Amplifier: designators end in _DACs_U_DAC_LTC2000_Amplifier#15; ports AMP_PD=DAC_PD2 AOUT_N=AOUT_N2 AOUT_P=AOUT_P2 IOUT_N=IOUT_N_U_DAC_LTC2000 IOUT_P=IOUT_P_U_DAC_LTC2000
DACs/U_DAC_LTC2000/Amplifier: designators end in _DACs_U_DAC_LTC2000_Amplifier#16; ports AMP_PD=DAC_PD3 AOUT_N=AOUT_N3 AOUT_P=AOUT_P3 IOUT_N=IOUT_N_U_DAC_LTC2000 IOUT_P=IOUT_P_U_DAC_LTC2000
DACs/U_DAC_LTC2000/Amplifier: designators end in _DACs_U_DAC_LTC2000_Amplifier#17; ports AMP_PD=DAC_PD4 AOUT_N=AOUT_N4 AOUT_P=AOUT_P4 IOUT_N=IOUT_N_U_DAC_LTC2000 IOUT_P=IOUT_P_U_DAC_LTC2000
DACs/U_DAC_LTC2000/Amplifier: designators end in _DACs_U_DAC_LTC2000_Amplifier#18; ports AMP_PD=DAC_PD5 AOUT_N=AOUT_N5 AOUT_P=AOUT_P5 IOUT_N=IOUT_N_U_DAC_LTC2000 IOUT_P=IOUT_P_U_DAC_LTC2000

### Layout directives
differential pair; differential pair class V_analog: AOUT_N12, AOUT_P12

### Notes on the sheet
- Project/Equipment
- Document
- Designer
- Drawn by
- Check.by
- File
- Last Mod.
- Print Date
- Sheet
- Size
- A3
- of
- Rev
- (in symbol CTE3216-18_10UF_10V_10%_LESR1800) +
- (in symbol R0402_10K_1%_0.0625W_100PPM) 1%
- (in symbol R0402_63R4_0.1%_0.063W_10PPM) 0.1%
- (in symbol R0603_41R2_0.1%_0.063W_10PPM) 0.1%
- (in symbol R0603_255R_0.1%_0.063W_10PPM) 0.1%

### Library data of the parts
C1021 C1024 = CC0201_1NF_16V_10%_X5R: Non-polarised capacitor; Part Description: SMD Multilayer Chip Ceramic Capacitor; Manufacturer: GENERIC; Manufacturer1 Part Number: 0201YD102KAT2A; Voltage: 16V; TC: X5R; Tolerance: ±10%; Part Number: CC0201_1NF_16V_10%_X5R; Component Kind: Standard; Component Type: Standard; Pin Count: 2; Value: 1nF; Status: Not Recommended; Manufacturer Part Number: CC0201_1NF_16V_10%_X5R; Case: 0201; Mounted: Yes; Socket: No; SMD: Yes; Sense: No; Manufacturer1 Example: AVX; Manufacturer1 ComponentHeight: 0.33mm; HelpURL: \\cern.ch\dfs\Applications\Altium\Datasheets\CC0201_X5R_AVX.pdf; Author: CERN DEM JLC; CreateDate: 03.12.2007; LatestRevisionDate: 03.12.2007
C1022 C1025 = CC0201_100NF_6.3V_10%_X5R: Non-polarised capacitor; Part Description: SMD Multilayer Chip Ceramic Capacitor; Manufacturer: GENERIC; Manufacturer1 Part Number: 02016D104KAT2A; Voltage: 6.3V; TC: X5R; Tolerance: ±10%; Part Number: CC0201_100NF_6.3V_10%_X5R; Component Kind: Standard; Component Type: Standard; Pin Count: 2; Value: 100nF; Status: Not Recommended; Manufacturer Part Number: CC0201_100NF_6.3V_10%_X5R; Case: 0201; Mounted: Yes; Socket: No; SMD: Yes; Sense: No; Manufacturer1 Example: AVX; Manufacturer1 ComponentHeight: 0.33mm; HelpURL: \\cern.ch\dfs\Applications\Altium\Datasheets\CC0201_X5R_AVX.pdf; Author: CERN DEM JLC; CreateDate: 03.12.2007; LatestRevisionDate: 03.12.2007
C1023 C1026 = CTE3216-18_10UF_10V_10%_LESR1800: Polarised capacitor; Part Description: Low ESR 1R8 Solid Tantalum Chip Capacitor; Manufacturer: GENERIC; Manufacturer1 Part Number: TPSA106K010R1800; Voltage: 10V; Tolerance: ±10%; Part Number: CTE3216-18_10UF_10V_10%_LESR1800; Component Kind: Standard; Component Type: Standard; Pin Count: 2; Value: 10uF; Status: Preferred; Manufacturer Part Number: CTE3216-18_10UF_10V_10%_LESR1800; Case: A; Mounted: Yes; Socket: No; SMD: Yes; Sense: No; Manufacturer1 Example: AVX; Manufacturer1 ComponentHeight: 1.8mm; HelpURL: \\cern.ch\dfs\Applications\Altium\Datasheets\CTE-LESR_AVX_TPS.pdf; Author: CERN DEM JLC; CreateDate: 05.05.2008; LatestRevisionDate: 20.01.2009
IC1001 = ADA4927-1YCPZ-R2: Ultralow Distortion Current Feedback Differential ADC Driver; Manufacturer: ANALOG DEVICES; PressFit: No; Bonding: No; Part Number: ADA4927-1YCPZ-R2; Component Kind: Standard; Component Type: Standard; Device: ADA4927-1YCPZ-R2; PackageDescription: QFN,0.50mm pitch,square; 4 pin X 4 pin, 3mm X 3mm X 1.00mm H body (w/thermal tab 1.45 X 1.45mm),  IPC Medium Density; Part Description: Ultralow Distortion Current Feedback Differential ADC Driver; Manufacturer Part Number: ADA4927-1YCPZ-R2; Pin Count: 17; Case: QFN16; Mounted: Yes; Socket: No; SMD: Yes; Sense: No; ComponentHeight: 1mm; Author: CERN DEM JLC; HelpURL: \\cern.ch\dfs\Applications\Altium\Datasheets\ADA4927-1YCPZ-R2.pdf; CreateDate: 19.04.2010; LatestRevisionDate: 19.04.2010
L1000 L1001 = IND0603_MURATA_BLM18PG121SN1D: Inductor; Part Description: SMD EMIFIL Chip Ferrite Bead; Manufacturer: MURATA; Power: 2A; Resistance: 0.05R; Part Number: IND0603_MURATA_BLM18PG121SN1D; Component Kind: Standard; Component Type: Standard; Pin Count: 2; Value: 120R@100MHz; Status: None; Manufacturer Part Number: BLM18PG121SN1D; Case: 0603; Mounted: Yes; Socket: No; SMD: Yes; Sense: No; ComponentHeight: 0.95mm; HelpURL: \\cern.ch\dfs\Applications\Altium\Datasheets\IND0603_MURATA_BLM18P.pdf; Author: CERN DEM BC; CreateDate: 27.07.2015; LatestRevisionDate: 27.07.2015
R1020 R1023 = R0402_63R4_0.1%_0.063W_10PPM: Resistor - 0.1%; Manufacturer: GENERIC; Manufacturer1 Part Number: RN73C1E63R4BTD; Part Description: Thin Film Chip Resistor; Authorr: TPrzywoz; Power: 0.063W; PressFit: No; TC: ±10ppm; Component Kind: Standard; Component Type: Standard; CreateDate: 06.12.2018; LatestRevisionDate: 09.03.2017; Manufacturer Part Number: R0402_63R4_0.1%_0.063W_10PPM; Manufacturer1 ComponentHeight: 0.35mm; Case: 0402; Manufacturer1 Example: TE Connectivity Passive Product; Mounted: Yes; Part Number: R0402_63R4_0.1%_0.063W_10PPM; Pin Count: 2; Sense: No; SMD: Yes; Socket: No; Status: Not Recommended; Tolerance: ±0.1%; Value: 63R4
R1021 R1024 = R0603_255R_0.1%_0.063W_10PPM: Resistor - 0.1%; Part Description: Thin Film Chip Resistor; Manufacturer: GENERIC; Manufacturer1 Part Number: RN73C1J255RBTDF; Power: 0.063W; TC: ±10ppm; PressFit: No; Part Number: R0603_255R_0.1%_0.063W_10PPM; Component Kind: Standard; Component Type: Standard; Pin Count: 2; Value: 255; Status: Not Recommended; Tolerance: ±0.1%; Manufacturer Part Number: R0603_255R_0.1%_0.063W_10PPM; Case: 0603; Mounted: Yes; Sense: No; Socket: No; SMD: Yes; Manufacturer1 Example: TYCO HOLSWORTHY; Manufacturer1 ComponentHeight: 0.5mm; HelpURL: \\cern.ch\dfs\Applications\Altium\Datasheets\R0603_Tyco_RN73.pdf; Author: CERN DEM JLC; CreateDate: 03.12.2007; LatestRevisionDate: 13.03.2008
R1022 R1025 = R0603_41R2_0.1%_0.063W_10PPM: Resistor - 0.1%; Part Description: Thin Film Chip Resistor; Manufacturer: GENERIC; Manufacturer1 Part Number: RN73C1J41R2BTDF; Power: 0.063W; TC: ±10ppm; PressFit: No; Part Number: R0603_41R2_0.1%_0.063W_10PPM; Component Kind: Standard; Component Type: Standard; Pin Count: 2; Value: 41R2; Status: Not Recommended; Tolerance: ±0.1%; Manufacturer Part Number: R0603_41R2_0.1%_0.063W_10PPM; Case: 0603; Mounted: Yes; Sense: No; Socket: No; SMD: Yes; Manufacturer1 Example: TYCO HOLSWORTHY; Manufacturer1 ComponentHeight: 0.5mm; HelpURL: \\cern.ch\dfs\Applications\Altium\Datasheets\R0603_Tyco_RN73.pdf; Author: CERN DEM JLC; CreateDate: 03.12.2007; LatestRevisionDate: 13.03.2008
R1026 R1027 = R0402_10K_1%_0.0625W_100PPM: as R1018 on sheet DAC_LTC2000; Manufacturer Part Number: R0402_10K_1%_0.0625W_100PPM; Part Number: R0402_10K_1%_0.0625W_100PPM; Tolerance: ±1%; Value: 10k; Component Kind: Standard; Component Type: Standard; Pin Count: 2; Status: Not Recommended; Power: 0.0625W; Case: 0402; Mounted: Yes; Sense: No; Socket: No; SMD: Yes; Manufacturer1 Example: YAGEO PHYCOMP; Manufacturer1 ComponentHeight: 0.4mm; HelpURL: \\cern.ch\dfs\Applications\Altium\Datasheets\R0402_Phycomp_RC0402.pdf; Author: CERN DEM JLC; CreateDate: 03.12.2007; LatestRevisionDate: 17.10.2012
T1000 = BSS84LT1G: P-CHANNEL MOSFET WITH DIODE; Part Description: 50V 130mA Single P-Channel Power MOSFET; Manufacturer: ON SEMICONDUCTOR; PressFit: No; Bonding: No; Part Number: BSS84LT1G; Component Kind: Standard; Component Type: Standard; Device: BSS84LT1G; PackageDescription: SOT23 3-Leads, Pitch 0.95mm - Body 1.4x3mm, IPC Medium Density; Manufacturer Part Number: BSS84LT1G; Pin Count: 3; Case: SOT23-3; Mounted: Yes; Socket: No; SMD: Yes; Sense: No; ComponentHeight: 1.1mm; HelpURL: \\cern.ch\dfs\Applications\Altium\Datasheets\BSS84LT1G.pdf; Author: CERN DEM JLC; CreateDate: 29.03.2012; LatestRevisionDate: 29.03.2012
T1001 = BSH103: N-CHANNEL MOSFET WITH DIODE; Manufacturer: NEXPERIA; Part Description: 30V 850mA N-Channel Enhancement Mode Field-Effect Transistor; PressFit: No; Bonding: No; Manufacturer Part Number: BSH103; PackageDescription: SOT23, 3 pin, Pitch 0.95mm - 1.3mm W X 2.9mm L X 1.1mm H, IPC Medium Density; Part Number: BSH103; Component Kind: Standard; Component Type: Standard; Device: BSH103; Pin Count: 3; Case: SOT23-3; Mounted: Yes; Socket: No; SMD: Yes; Sense: No; ComponentHeight: 1.1mm; HelpURL: \\cern.ch\dfs\Applications\Altium\Datasheets\BSH103.pdf; Author: CERN DEM JLC; CreateDate: 16.03.2010; LatestRevisionDate: 20.06.2017